# Altium schematic sheet Subsheet_CAN.SchDoc
size A4; Organization: Altium Limited; Address1: L3, 12a Rodborough Rd; Address2: Frenchs Forest; Address3: NSW; Address4: Australia 2086
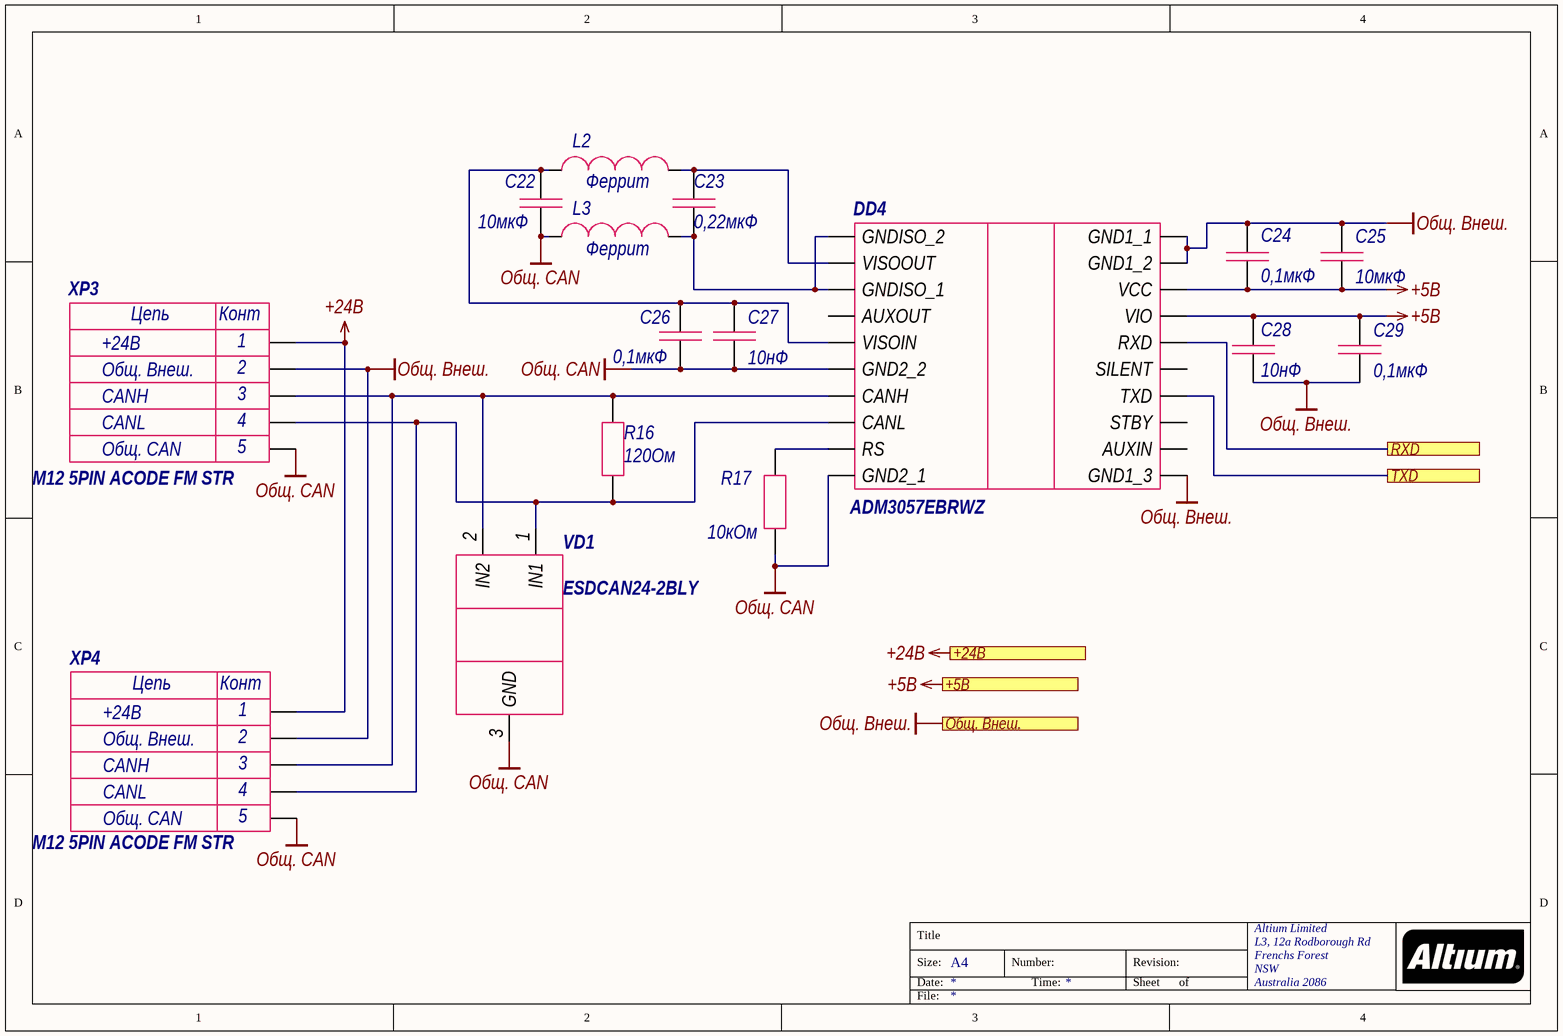
[diagram p0: Subsheet_CAN.SchDoc]

## Parts
C22  value 10мкФ  [0805C]  (hidden comment: Capacitor)
C23  value 0,22мкФ  [0603C]  (hidden comment: Capacitor)
C24  value 0,1мкФ  [0603C]  (hidden comment: Capacitor)
C25  value 10мкФ  [0805C]  (hidden comment: Capacitor)
C26  value 0,1мкФ  [0603C]  (hidden comment: Capacitor)
C27  value 10нФ  [0603C]  (hidden comment: Capacitor)
C28  value 10нФ  [0603C]  (hidden comment: Capacitor)
C29  value 0,1мкФ  [0603C]  (hidden comment: Capacitor)
DD4  ADM3057EBRWZ  [SOIC-20N]
L2  value Феррит  [0402]  (hidden comment: Inductance)
L3  value Феррит  [0402]  (hidden comment: Inductance)
R16  value 120Ом  [0603R]  (hidden comment: Resistor)
R17  value 10кОм  [0603R]  (hidden comment: Resistor)
VD1  ESDCAN24-2BLY  [SOT23-3L]
XP3  value M12 5PIN ACODE FM STR  Value1: +24В  Value2: Общ. Внеш.  Value3: CANH  Value4: CANL  Value5: Общ. CAN  [M12_ACODE_5PIN_FM_STR]  (hidden comment: 5_PIN_XP)
XP4  value M12 5PIN ACODE FM STR  Value1: +24В  Value2: Общ. Внеш.  Value3: CANH  Value4: CANL  Value5: Общ. CAN  [M12_ACODE_5PIN_FM_STR]  (hidden comment: 5_PIN_XP)

## Ports
+5В, +24В, RXD, TXD, Общ. Внеш.

## Nets
+5В: C24.1 C25.1 C28.2 C29.2 DD4.3(VCC) DD4.4(VIO) ; port +5В
+24В: XP3.1 XP4.1 ; port +24В
Общ. CAN: C22.1 C26.1 C27.1 DD4.11(GND2_1) DD4.15(GND2_2) L3.1 R17.1 VD1.3(GND) XP3.5 XP4.5
Общ. Внеш.: C24.2 C25.2 C28.1 C29.1 DD4.1(GND1_1) DD4.2(GND1_2) DD4.10(GND1_3) XP3.2 XP4.2 ; port Общ. Внеш.
RXD: DD4.5(RXD) ; port RXD
TXD: DD4.7(TXD) ; port TXD
NetC22_2: C22.2 C26.2 C27.2 DD4.16(VISOIN) L2.1
NetC23_1: C23.1 DD4.18(GNDISO_1) DD4.20(GNDISO_2) L3.2
NetC23_2: C23.2 DD4.19(VISOOUT) L2.2
NetDD4_12: DD4.12(RS) R17.2
NetDD4_13: DD4.13(CANL) R16.1 VD1.1(IN1) XP3.4 XP4.4
NetDD4_14: DD4.14(CANH) R16.2 VD1.2(IN2) XP3.3 XP4.3

Not connected (* = marked no-connect by the designer): DD4 6(SILENT) 8(STBY) 9(AUXIN) 17(AUXOUT)

## Notes on the sheet
- Title
- Size:
- Date:
- A4
- Number:
- Time:
- Revision:
- Sheet
- of
- File:
- (in symbol 12B011) Цепь; Конт

## Library data of the parts
C22 C25 = GRM21BR61C106KE15L: Type: Керамический; Parameter: 16В; Tolerance: 10%; Part Name: GRM21BR61C106KE15L; Package: 0805; Shop Link: https://www.terraelectronica.ru/product/566229
C23 = CC0603JRX7R6BB224: Type: Керамический; Parameter: 10В; Tolerance: 5%; Part Name: CC0603JRX7R6BB224; Package: 0603; Shop Link: https://www.terraelectronica.ru/product/882662
C24 C26 C29 = 06035C104KAT2A: Type: Керамический; Parameter: 50В; Tolerance: 10%; Part Name: 06035C104KAT2A; Package: 0603; Shop Link: https://www.terraelectronica.ru/product/577475
C27 C28 = GRM188R72A103KA01D: Type: Керамический; Parameter: 100В; Tolerance: 10%; Part Name: GRM188R72A103KA01D; Package: 0603; Shop Link: https://www.terraelectronica.ru/product/1066366
DD4 = ADM3057EBRWZ: CAN; Parameter: 1,7... 5,5В; Value: ADM3057EBRWZ; Part Name: ADM3057EBRWZ; Type: Изолированный приемопередатчик; Package: SOIC-20; Shop Link: https://www.elitan.ru/price/item20186299
L2 L3 = BLM15HD182SN1D: Type: Ферритовая бусина; Parameter: 1,8кОм; Part Name: BLM15HD182SN1D; Package: 0402; Shop Link: https://www.terraelectronica.ru/product/557145
R16 = RC0603JR-07120RL: Tolerance: 5%; Part Name: RC0603JR-07120RL; Type: Resistor; Package: 0603R; Shop Link: https://www.terraelectronica.ru/product/328415
R17 = RC0603JR-0710KL: Tolerance: 5%; Part Name: RC0603JR-0710KL; Type: Resistor; Package: 0603R; Shop Link: https://www.terraelectronica.ru/product/562124
VD1 = ESDCAN24-2BLY: TVS; Type: Защитный; Parameter: 40В ; 5,5А; Value: ESDCAN24-2BLY; Part Name: ESDCAN24-2BLY; Package: SOT-23-3L; Shop Link: https://www.terraelectronica.ru/product/1048813
XP3 XP4 = 12B011: A code ; Female ; Front mount; Part Name: 12B011; Tolerance: straight; Type: Разъем; Package: M12; Parameter: Front mount